# Altium schematic sheet Sensors.SchDoc
size A4
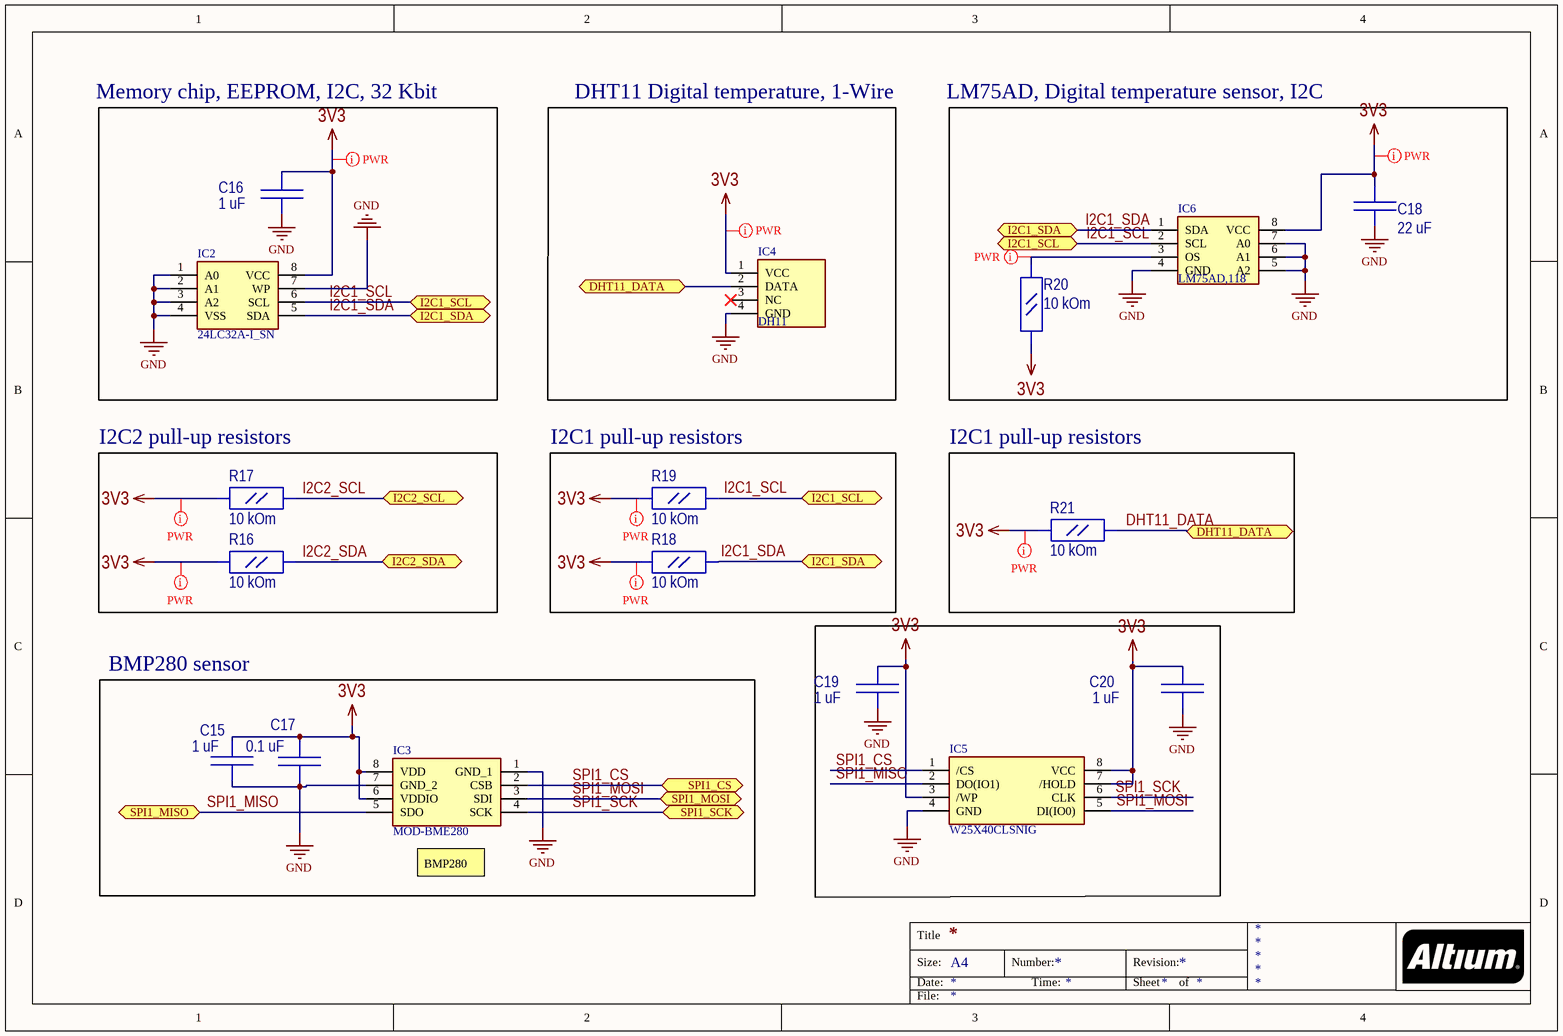
[diagram p0: Sensors.SchDoc]

## Parts
C15  1 uF  [C_0805]
C16  1 uF  [C_0805]
C17  0.1 uF  [C_0805]
C18  22 uF  [C_0805]
C19  1 uF  [C_0805]
C20  1 uF  [C_0805]
IC2  24LC32A-I_SN  [SOIC127P600X175-8N]
IC3  MOD-BME280  [MODBME280]
IC4  DH11  [HDRV4W80P0X254_1X4_1200X500X1550P]
IC5  W25X40CLSNIG  [SOIC127P600X175-8N]
IC6  LM75AD,118  [SOIC127P600X175-8N]
R16  10 kOm  [R_0805]
R17  10 kOm  [R_0805]
R18  10 kOm  [R_0805]
R19  10 kOm  [R_0805]
R20  10 kOm  [R_0805]
R21  10 kOm  [R_0805]

## Blocks framed on the sheet
Memory chip, EEPROM, I2C, 32 Kbit: C16 IC2
DHT11 Digital temperature, 1-Wire: IC4
LM75AD, Digital temperature sensor, I2C: C18 IC6 R20
I2C2 pull-up resistors: R16 R17
I2C1 pull-up resistors: R18 R19
I2C1 pull-up resistors: R21
BMP280 sensor: C15 C17 IC3

## Ports
DHT11_DATA (bidir), I2C1_SCL (bidir), I2C1_SDA (bidir), I2C2_SCL (bidir), I2C2_SDA (bidir), SPI1_CS (bidir), SPI1_MISO (bidir), SPI1_MOSI (bidir), SPI1_SCK (bidir)

## Nets
3V3: C15.2 C16.2 C17.2 C18.2 C19.2 C20.2 IC2.8(VCC) IC3.6(VDDIO) IC3.8(VDD) IC4.1(VCC) IC5.3(/WP) IC5.7(/HOLD) IC5.8(VCC) IC6.8(VCC) R16.1 R17.1 R18.1 R19.1 R20.1 R21.1
GND: C15.1 C16.1 C17.1 C18.1 C19.1 C20.1 IC2.1(A0) IC2.2(A1) IC2.3(A2) IC2.4(VSS) IC2.7(WP) IC3.1(GND_1) IC3.7(GND_2) IC4.4(GND) IC5.4(GND) IC6.4(GND) IC6.5(A2) IC6.6(A1) IC6.7(A0)
DHT11_DATA: IC4.2(DATA) R21.2 ; port DHT11_DATA
I2C1_SCL: IC2.6(SCL) IC6.2(SCL) R19.2 ; port I2C1_SCL
I2C1_SDA: IC2.5(SDA) IC6.1(SDA) R18.2 ; port I2C1_SDA
I2C2_SCL: R17.2 ; port I2C2_SCL
I2C2_SDA: R16.2 ; port I2C2_SDA
SPI1_CS: IC3.2(CSB) IC5.1(/CS) ; port SPI1_CS
SPI1_MISO: IC3.5(SDO) IC5.2(DO(IO1)) ; port SPI1_MISO
SPI1_MOSI: IC3.3(SDI) IC5.5(DI(IO0)) ; port SPI1_MOSI
SPI1_SCK: IC3.4(SCK) IC5.6(CLK) ; port SPI1_SCK
NetIC6_3: IC6.3(OS) R20.2

Not connected (* = marked no-connect by the designer): IC4 3(NC)*

## Layout directives
net class PWR: 3V3, NetIC6_3

## Notes on the sheet
- (near IC3) BMP280
- Title
- Size:
- Date:
- A4
- Number:
- Time:
- Revision:
- Sheet
- of
- File:

## Library data of the parts
C15-C17 C19 C20 = C_0805: Value: 1mF
C18 = C_0805: Value: 22mF
IC2 = 24LC32A-I_SN: Integrated Circuit; Manufacturer_Name: Microchip; Manufacturer_Part_Number: 24LC32A-I/SN; Datasheet Link: http://ww1.microchip.com/downloads/en/DeviceDoc/21713M.pdf; Height: 1.75mm; Mouser Part Number: 579-24LC32A-I/SN; Mouser Price/Stock: https://www.mouser.co.uk/ProductDetail/Microchip-Technology/24LC32A-I-SN?qs=KwArPi4cUogiVlLk9E3nOw%3D%3D; Arrow Part Number: 24LC32A-I/SN; Arrow Price/Stock: https://www.arrow.com/en/products/24lc32a-isn/microchip-technology
IC3 = MOD-BME280: Integrated Circuit; Manufacturer_Name: Olimex Ltd.; Datasheet Link: https://eu.mouser.com/datasheet/2/306/BME280-1620794.pdf; Height: 1mm; Manufacturer_Part_Number: MOD-BME280; Mouser Part Number: 909-MOD-BME280; Mouser Price/Stock: https://www.mouser.co.uk/ProductDetail/Olimex-Ltd/MOD-BME280?qs=%252B6g0mu59x7K82sEO3yPPgg%3D%3D
IC4 = 101020011: Integrated Circuit; Manufacturer_Name: Seeed Studio; Datasheet Link: https://componentsearchengine.com/Datasheets/1/101020011.pdf; Height: 15.5mm; Manufacturer_Part_Number: 101020011; Mouser Part Number: 713-101020011; Mouser Price/Stock: https://www.mouser.co.uk/ProductDetail/Seeed-Studio/101020011?qs=1%252B9yuXKSi8Dq%252B99bte6U5Q%3D%3D; Arrow Part Number: 101020011; Arrow Price/Stock: https://www.arrow.com/en/products/101020011/seeed-technology-limited
IC5 = W25X40CLSNIG: Integrated Circuit; Manufacturer_Name: Winbond; Datasheet Link: https://www.winbond.com/resource-files/w25x40cl_f 20140325.pdf; Height: 1.75mm; Manufacturer_Part_Number: W25X40CLSNIG; Mouser Part Number: 454-W25X40CLSNIG; Mouser Price/Stock: https://www.mouser.co.uk/ProductDetail/Winbond/W25X40CLSNIG?qs=qSfuJ%252Bfl%2Fd6X%252Bb%2FMViqBBg%3D%3D; Arrow Part Number: W25X40CLSNIG; Arrow Price/Stock: https://www.arrow.com/en/products/w25x40clsnig/winbond-electronics?region=nac
IC6 = LM75AD,118: Integrated Circuit; Manufacturer_Name: NXP; Datasheet Link: http://www.nxp.com/docs/en/data-sheet/LM75A.pdf; Height: 1.75mm; Manufacturer_Part_Number: LM75AD,118; Mouser Part Number: 771-LM75AD-T; Mouser Price/Stock: https://www.mouser.co.uk/ProductDetail/NXP-Semiconductors/LM75AD118?qs=LOCUfHb8d9tvtApDiOTqqg%3D%3D; Arrow Part Number: LM75AD,118; Arrow Price/Stock: https://www.arrow.com/en/products/lm75ad118/nxp-semiconductors?region=nac
R16-R21 = R_0805: Value: 10 kOm